# EAGLE design valentines-heart-punk-r1.1-rotated (EAGLE 5.12)
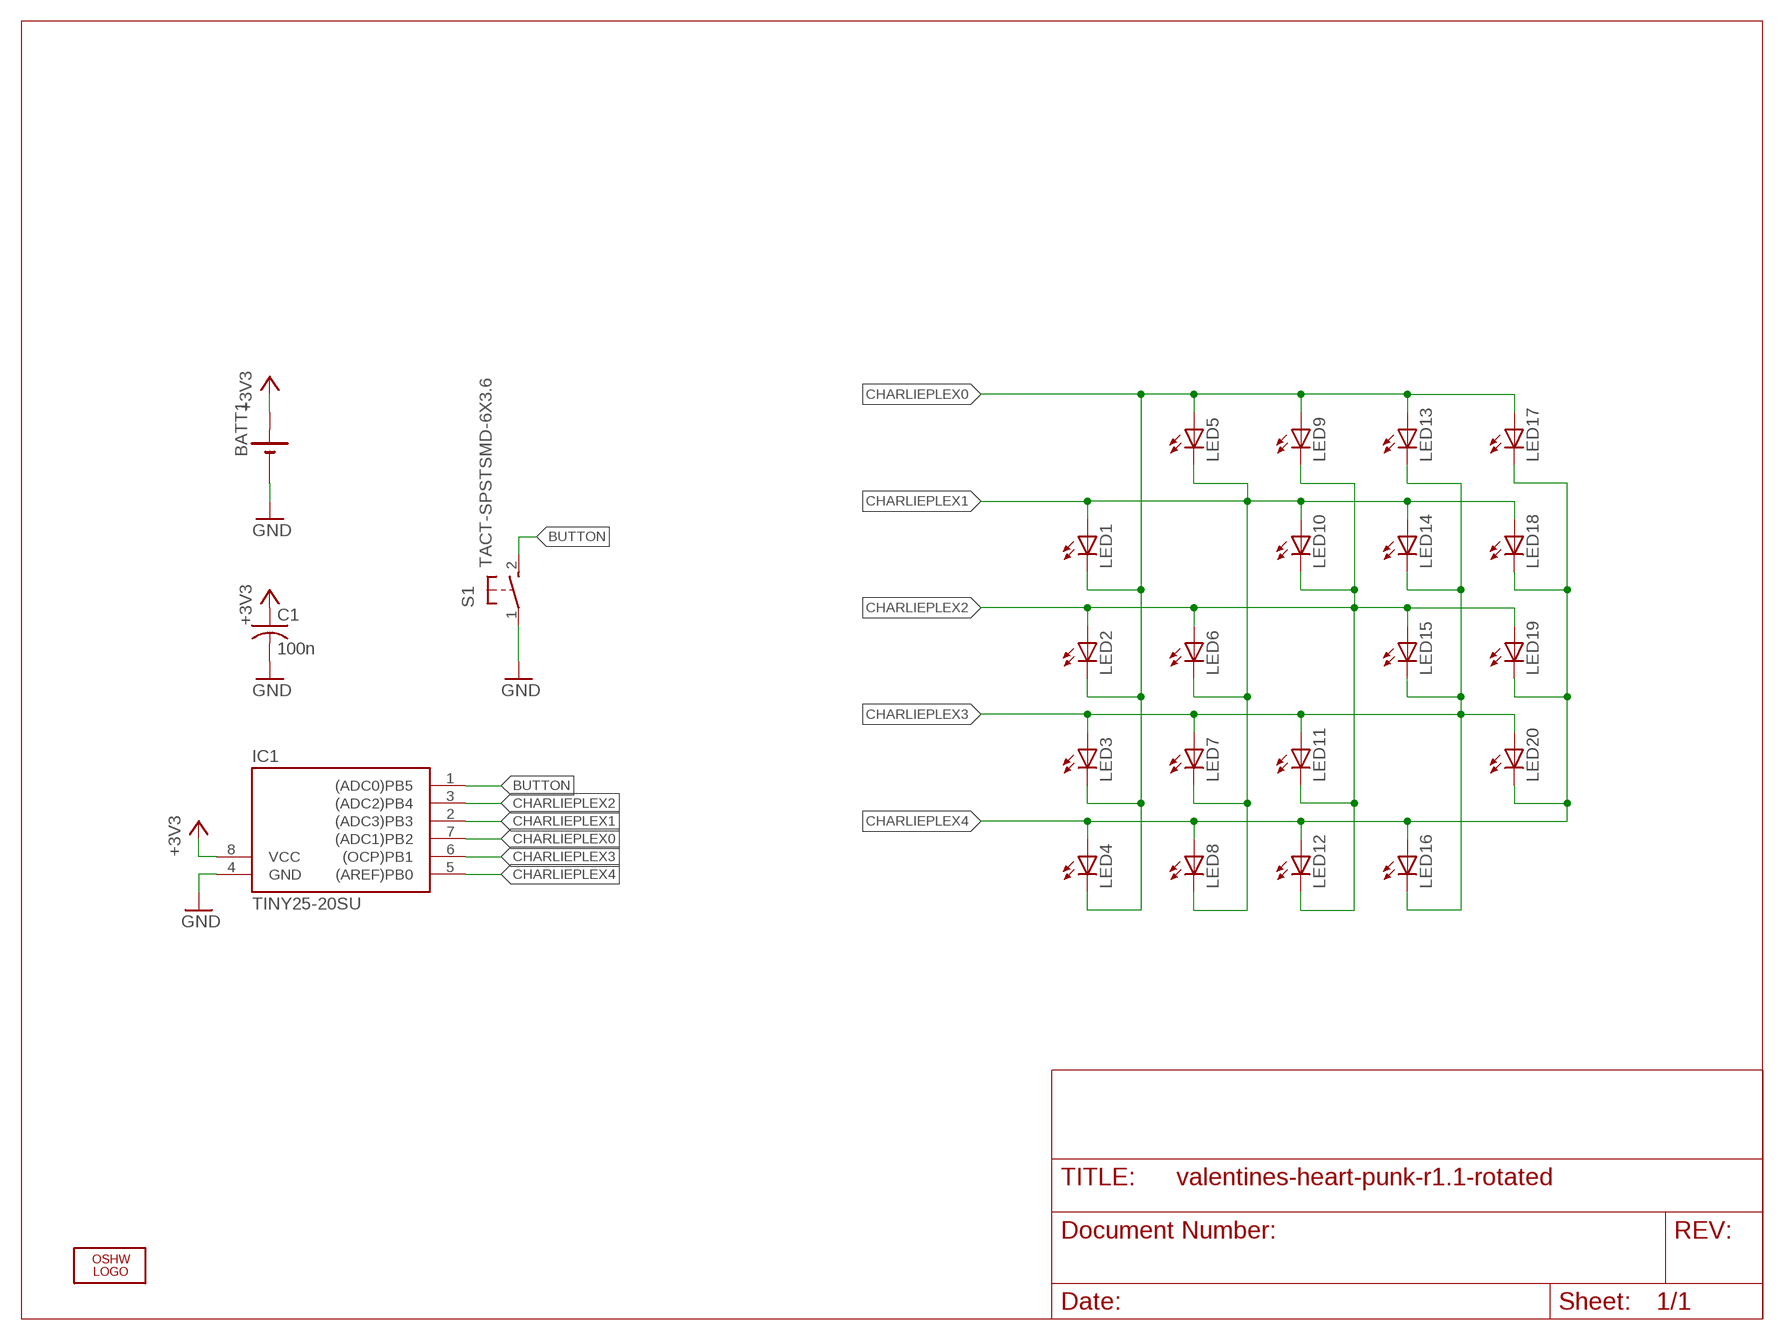
[diagram p0: schematic, sheet 1]

## Parts
BATT1  2032SMD  [2032SMD]
C1  100n  C-USC0603  [C0603]
IC1  TINY25-20SU  [SOIC8]
LED1  LEDCHIPLED_0805  [CHIPLED_0805]
LED2  LEDCHIPLED_0805  [CHIPLED_0805]
LED3  LEDCHIPLED_0805  [CHIPLED_0805]
LED4  LEDCHIPLED_0805  [CHIPLED_0805]
LED5  LEDCHIPLED_0805  [CHIPLED_0805]
LED6  LEDCHIPLED_0805  [CHIPLED_0805]
LED7  LEDCHIPLED_0805  [CHIPLED_0805]
LED8  LEDCHIPLED_0805  [CHIPLED_0805]
LED9  LEDCHIPLED_0805  [CHIPLED_0805]
LED10  LEDCHIPLED_0805  [CHIPLED_0805]
LED11  LEDCHIPLED_0805  [CHIPLED_0805]
LED12  LEDCHIPLED_0805  [CHIPLED_0805]
LED13  LEDCHIPLED_0805  [CHIPLED_0805]
LED14  LEDCHIPLED_0805  [CHIPLED_0805]
LED15  LEDCHIPLED_0805  [CHIPLED_0805]
LED16  LEDCHIPLED_0805  [CHIPLED_0805]
LED17  LEDCHIPLED_0805  [CHIPLED_0805]
LED18  LEDCHIPLED_0805  [CHIPLED_0805]
LED19  LEDCHIPLED_0805  [CHIPLED_0805]
LED20  LEDCHIPLED_0805  [CHIPLED_0805]
LOGO1  OSHW_LOGO_FILLX0100-NT  [OSHW_FILLX100_NOTEXT]
S1  TACT-SPSTSMD-6X3.6  [6X3.6-SPST]

## Nets
+3V3: BATT1.+ C1.1 IC1.8(VCC)
BUTTON: IC1.1((ADC0)PB5) S1.2(S)
CHARLIEPLEX0: IC1.7((ADC1)PB2) LED1.C LED2.C LED3.C LED4.C LED5.A LED9.A LED13.A LED17.A
CHARLIEPLEX1: IC1.2((ADC3)PB3) LED1.A LED5.C LED6.C LED7.C LED8.C LED10.A LED14.A LED18.A
CHARLIEPLEX2: IC1.3((ADC2)PB4) LED2.A LED6.A LED9.C LED10.C LED11.C LED12.C LED15.A LED19.A
CHARLIEPLEX3: IC1.6((OCP)PB1) LED3.A LED7.A LED11.A LED13.C LED14.C LED15.C LED16.C LED20.A
CHARLIEPLEX4: IC1.5((AREF)PB0) LED4.A LED8.A LED12.A LED16.A LED17.C LED18.C LED19.C LED20.C
GND: BATT1.- C1.2 IC1.4(GND) S1.1(P)

## Library data of the parts
BATT1 = rbg-4ucon-battery:2032SMD
C1 = rcl:C-US: CAPACITOR, American symbol
IC1 = avr-5-4.16:TINY25
LED1-LED20 = led:LED: LED OSRAM: - CHIPLED LG R971, LG N971, LY N971, LG Q971, LY Q971, LO R971, LY R971 LH N974, LH R974 LS Q976, LO Q976, LY Q976 LO Q996 - Hyper CHIPLED LW Q18S LB Q993, LB Q99A, LB R99A - SideLED LS A670, LO A670, LY A670, LG A670, LP A670 LB A673, LV A673, LT A673, LW A673 LH A674 LY A675 LS A676, LA A676, LO A676, LY A676, LW A676 LS A679, LY A679, LG A679 - Hyper Micro SIDELED® LS Y876, LA Y876, LO Y876, LY Y876 LT Y87S - SmartLED LW L88C, LW L88S LB L89C, LB L89S, LG L890 LS L89K, LO L89K, LY L89K LS L896, LA L896, LO L896, LY L896 - TOPLED LS T670, LO T670, LY T670, LG T670, LP T670 LSG T670, LSP T670, LSY T670, LOP T670, LYG T670 LG T671, LOG T671, LSG T671 LB T673, LV T673, LT T673, LW T673 LH T674 LS T676, LA T676, LO T676, LY T676, LB T676, LH T676, LSB T676, LW T676 LB T67C, LV T67C, LT T67C, LS T67K, LO T67K, LY T67K, LW E67C LS E67B, LA E67B, LO E67B, LY E67B, LB E67C, LV E67C, LT E67C LW T67C LS T679, LY T679, LG T679 LS T770, LO T770, LY T770, LG T770, LP T770 LB T773, LV T773, LT T773, LW T773 LH T774 LS E675, LA E675, LY E675, LS T675 LS T776, LA T776, LO T776, LY T776, LB T776 LHGB T686 LT T68C, LB T68C - Hyper Mini TOPLED® LB M676 - Mini TOPLED Santana® LG M470 LS M47K, LO M47K, LY M47K Source: http://www.osram.convergy.de LUXEON: - LUMILED® LXK2-PW12-R00, LXK2-PW12-S00, LXK2-PW14-U00, LXK2-PW14-V00 LXK2-PM12-R00, LXK2-PM12-S00, LXK2-PM14-U00 LXK2-PE12-Q00, LXK2-PE12-R00, LXK2-PE12-S00, LXK2-PE14-T00, LXK2-PE14-U00 LXK2-PB12-K00, LXK2-PB12-L00, LXK2-PB12-M00, LXK2-PB14-N00, LXK2-PB14-P00, LXK2-PB14-Q00 LXK2-PR12-L00, LXK2-PR12-M00, LXK2-PR14-Q00, LXK2-PR14-R00 LXK2-PD12-Q00, LXK2-PD12-R00, LXK2-PD12-S00 LXK2-PH12-R00, LXK2-PH12-S00 LXK2-PL12-P00, LXK2-PL12-Q00, LXK2-PL12-R00 Source: www.luxeon.com KINGBRIGHT: KA-3528ASYC Source: www.kingbright.com
LOGO1 = ohw-logo:OSHW_LOGO_FILL
S1 = rbg-generic-tact-switch:TACT-SPST

## Board
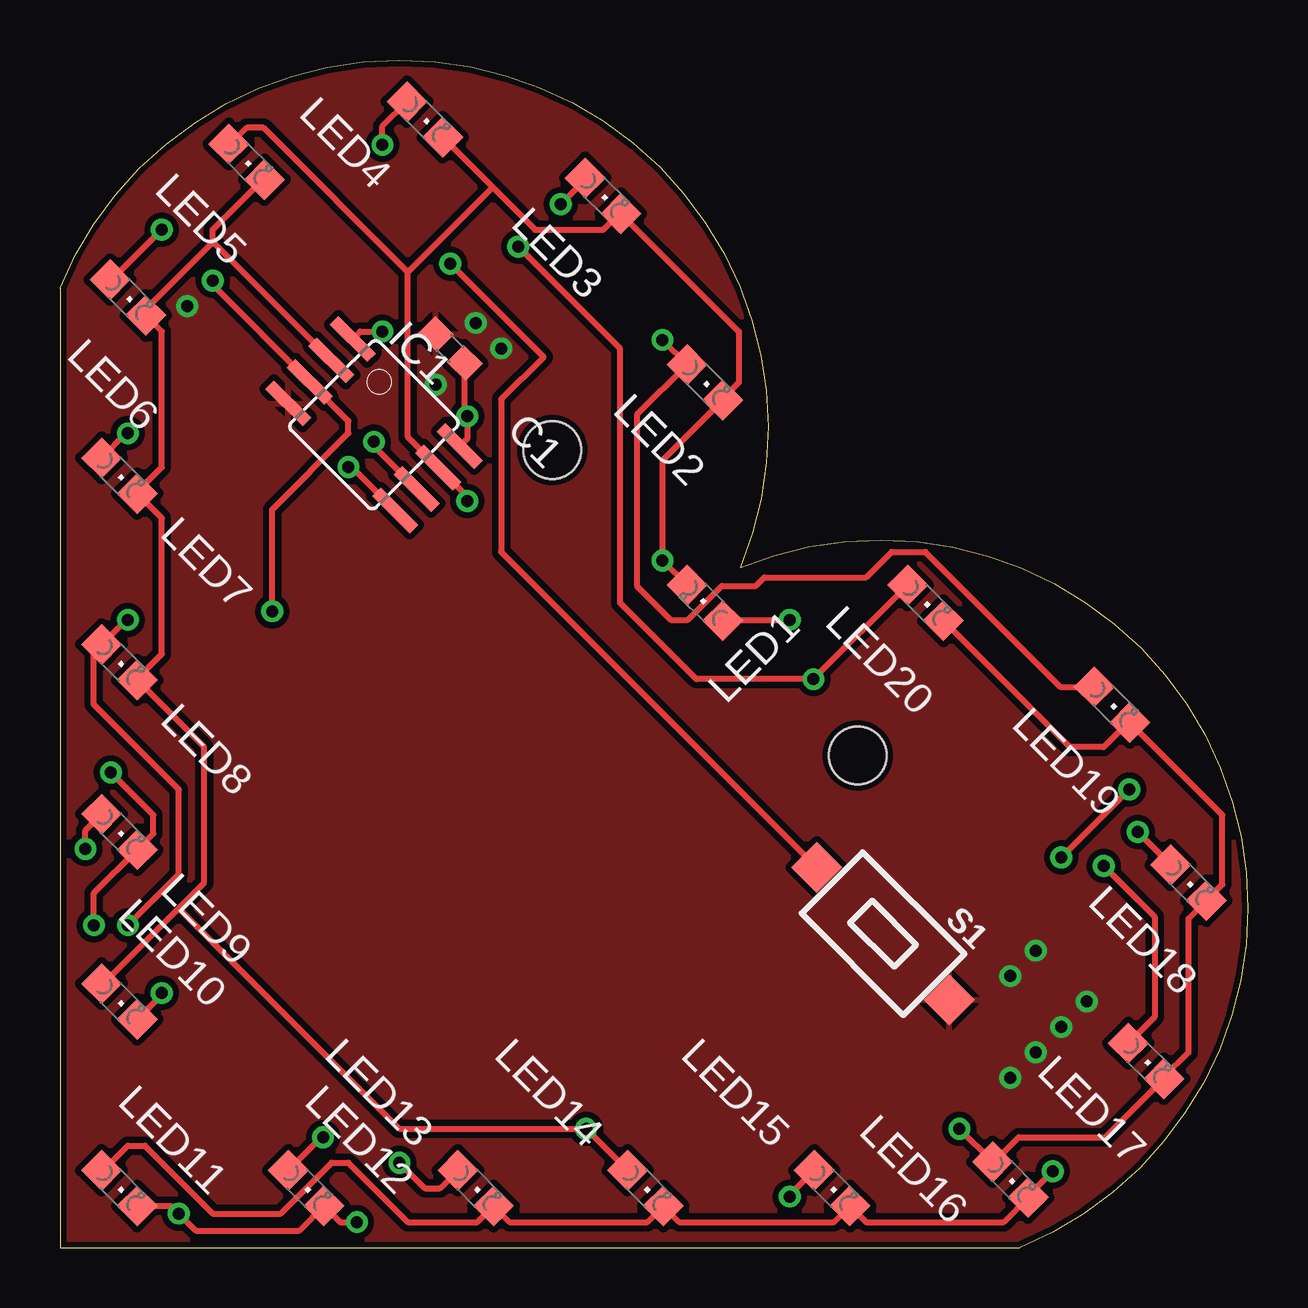
[diagram p1: board, top side]
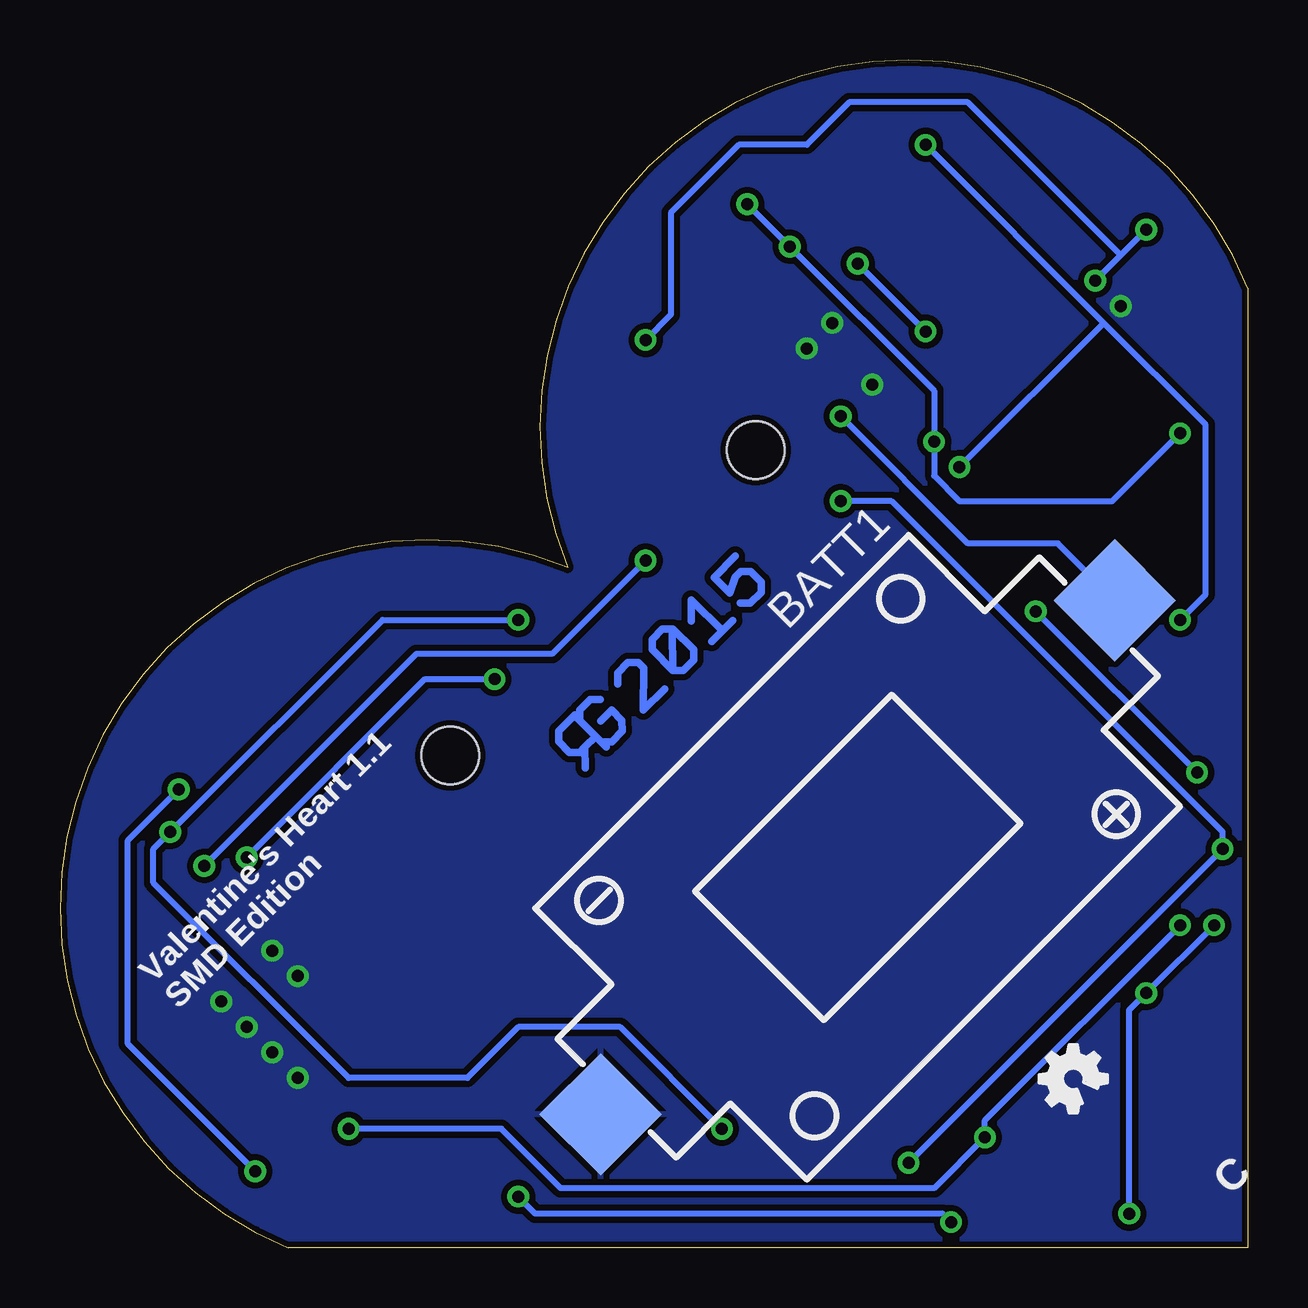
[diagram p2: board, bottom side, seen from below]

Size 49.5 x 49.5 mm. Coordinates in mm from the lower left corner, seen from the top.
Outline: 0,0 40,0 arc180 28.35,28.35 arc180 0,40 0,0
Copper layers (1*16): Top 0.035mm / dielectric 1.5mm / Bottom 0.035mm
Design rules "default *": minimum track width 10mil, minimum drill 0.5mm, track to track 8mil, track to pad 8mil, pad to pad 8mil, via to via 8mil, smd to smd 8mil, copper to edge 10mil, drill to drill 8mil, minimum pad ring 10mil, minimum via ring 8mil, stop-mask expansion 4mil, vias tented up to drill 20mil, thermal gap 10mil
Holes 2.4 mm at 20.51,33.23 33.23,20.51

### Footprints (pad centres in the part's own frame; a part is rotated, then mirrored left to right if it is on the bottom)
2032SMD = smd 3.6 x 3.6: + -15.15,0; - 15.15,0
C0603 = smd 1.1 x 1: 1 -0.85,0; 2 0.85,0
SOIC8 = smd 0.5 x 2.2: 1 -1.905,-3.154; 2 -0.645,-3.154; 3 0.625,-3.154; 4 1.895,-3.154; 5 1.905,3.154; 6 0.635,3.154; 7 -0.635,3.154; 8 -1.905,3.154
CHIPLED_0805 = smd 1.2 x 1.2: A 0,-1.05; C 0,1.05
6X3.6-SPST = smd 1.5 x 1.5: 1 -3.9,0; 2 3.9,0

### Placement (x,y rotation side)
BATT1  16.26,16.26 225 bottom
C1  16.26,37.48 135 top
IC1  13.08,34.29 225 top
LED1  26.87,26.87 45 top
LED2  26.87,36.06 225 top
LED3  22.63,43.84 225 top
LED4  15.2,47.02 225 top
LED5  7.78,45.25 225 top
LED6  2.83,39.6 225 top
LED7  2.47,32.17 225 top
LED8  2.47,24.4 225 top
LED9  2.47,17.32 225 top
LED10  2.47,10.25 225 top
LED11  2.47,2.47 225 top
LED12  10.25,2.47 225 top
LED13  17.32,2.47 225 top
LED14  24.4,2.47 225 top
LED15  32.17,2.47 225 top
LED16  39.6,2.83 225 top
LED17  45.25,7.78 225 top
LED18  47.02,15.2 225 top
LED19  43.84,22.63 225 top
LED20  36.06,26.87 225 top
LOGO1  7.5,5.23 45 bottom
S1  34.29,13.08 135 top
U$1  [RGLOGO_SMALL_2015]  26.52,20.86 45 bottom

### Tracks (layer width: path | path; a pad name or v marks a point on that pad's centre or on a via)
+3V3  (via drill 0.5)
  Top 0.254: v16.97,34.65 16.86,34.75 C1.1 | v16.97,34.65 16.97,34.48 | IC1.8 16.97,33.72 v16.97,34.65
  Bottom 0.254: BATT1.+ 7.92,29.34 11.67,29.34 v16.97,34.65
BUTTON  (via drill 0.5)
  Top 0.254: S1.2 18.39,28.99 18.39,35.35 20.15,37.12 v16.26,41.01 | IC1.1 12.51,38.18 v13.44,38.18
  Bottom 0.254: v13.44,38.18 v16.26,41.01
CHARLIEPLEX0  (via drill 0.5)
  Top 0.254: LED1.C v25.1,28.64 25.1,32.81 LED2.C 27.61,35.39 28.28,36.06 28.28,38.18 LED3.C 23.3,43.1 22.63,42.43 19.8,42.43 18.03,44.19 | 18.03,44.19 LED4.C | 14.5,40.66 8.48,46.67 7.78,46.67 7.11,46 LED5.A | 14.5,40.66 14.5,33.78 IC1.7 16.97,31.3 v16.97,31.11 | LED9.A 1.06,17.39 v1.06,16.62 | LED13.A 15.84,2.48 15.2,2.48 v14.14,3.54 | LED17.A 45.61,9.62 45.61,13.79 v43.49,15.91 | 14.5,40.66 18.03,44.19
  Bottom 0.254: v14.14,3.54 v1.06,16.62 1.06,17.32 14.85,31.11 v16.97,31.11 | v43.49,15.91 34.65,24.75 28.99,24.75 v25.1,28.64
CHARLIEPLEX1  (via drill 0.5)
  Top 0.254: 6.36,41.92 6.36,41.91 3.57,39.12 LED6.C 4.24,38.18 4.24,32.53 3.22,31.5 LED7.C 4.24,30.41 4.24,24.75 3.22,23.72 LED8.C 6.01,20.86 6.01,15.2 4.95,14.14 | LED5.C 8.45,44.51 6.36,42.43 6.36,41.92 | 4.95,14.14 1.8,10.99 LED10.A | 4.95,14.14 14.14,4.95 v21.92,4.95 LED14.A | v44.9,17.32 LED18.A | v30.41,26.16 30.37,26.13 LED1.A | 6.36,41.92 IC1.2
  Bottom 0.254: v30.41,26.16 36.06,26.16 v44.9,17.32 45.61,16.62 45.61,15.2 37.48,7.07 32.53,7.07 30.41,9.19 26.16,9.19 v21.92,4.95
CHARLIEPLEX2  (via drill 0.5)
  Top 0.254: 6.36,40.11 v6.36,40.3 6.36,40.13 IC1.3 12.02,34.46 12.02,33.94 8.84,30.76 v8.84,26.52 | v4.24,42.43 2.16,40.34 LED6.A | LED19.A 41.68,23.37 36.06,28.99 34.65,28.99 33.59,27.93 29.34,27.93 28.99,27.58 27.58,27.58 26.16,26.16 25.46,26.16 24.04,27.58 24.04,34.72 LED2.A v25.1,37.83 | v1.41,13.44 1.41,14.78 LED9.C 3.89,17.25 3.89,18.03 v2.12,19.8 | LED10.C 4.24,10.54 v4.24,10.61 | LED15.A 30.41,2.19 v30.41,2.12 | v12.37,1.06 11.67,1.06 LED12.C 9.97,0.71 5.66,0.71 v4.95,1.41 4.63,1.73 LED11.C
  Bottom 0.254: 5.3,41.37 v4.24,42.43 | v6.36,40.3 5.3,41.37 | v1.41,13.44 v4.24,10.61 4.95,9.9 v4.95,1.41 | v30.41,2.12 29.7,1.41 12.73,1.41 v12.37,1.06 | v25.1,37.83 24.04,38.89 24.04,43.13 21.21,45.96 18.39,45.96 16.62,47.73 11.67,47.73 5.3,41.37 | v2.12,19.8 v8.84,26.52
CHARLIEPLEX3  (via drill 0.5)
  Top 0.254: LED11.A 1.8,3.22 2.83,4.24 3.54,4.24 6.36,1.41 9.19,1.41 11.31,3.54 12.02,3.54 14.5,1.06 17.39,1.06 LED13.C 18.74,1.06 24.47,1.06 LED14.C 25.81,1.06 32.24,1.06 LED15.C 33.59,1.06 39.31,1.06 LED16.C 40.34,2.16 v41.37,3.18 | v20.86,43.49 21.92,44.55 LED3.A | LED7.A 2.76,33.94 v2.83,33.94 | v19.09,41.72 23.33,37.48 23.33,26.87 26.52,23.69 v31.39,23.69 LED20.A | v44.55,19.09 v41.72,16.26 | IC1.6 13.08,33.4 v13.08,33.59
  Bottom 0.254: v20.86,43.49 v19.09,41.72 13.08,35.71 v13.08,33.59 13.08,32.17 12.02,31.11 5.66,31.11 v2.83,33.94 | v31.39,23.69 34.3,23.69 v41.72,16.26 | v44.55,19.09 46.67,16.97 46.67,8.48 v41.37,3.18
CHARLIEPLEX4  (via drill 0.5)
  Top 0.254: LED20.C 42.07,20.86 43.49,20.86 44.51,21.89 LED19.C 48.44,18.03 48.44,15.13 LED18.C 47.02,13.72 47.02,8.13 46,7.11 LED17.C 43.56,4.6 39.95,4.6 38.93,3.57 LED16.A v37.48,4.95 | LED4.A 13.44,46.74 v13.44,45.96 | v2.83,26.16 2.76,26.16 LED8.A 1.41,24.82 1.41,22.63 4.95,19.09 4.95,15.56 v2.83,13.44 | LED12.A 10.89,4.6 v10.96,4.6 | IC1.5 12.15,32.53 v12.02,32.53
  Bottom 0.254: 6.01,38.54 v13.44,45.96 | 6.01,38.54 v12.02,32.53 | v2.83,26.16 1.77,27.22 1.77,34.3 6.01,38.54 | v37.48,4.95 31.11,4.95 28.64,2.48 13.08,2.48 v10.96,4.6 10.96,5.3 v2.83,13.44
GND  (via drill 0.5)
  other vias: 42.78,10.25 41.72,9.19 40.66,8.13 39.6,7.07 40.66,12.37 39.6,11.31 17.32,38.54 18.38,37.48 15.65,35.97 5.3,39.24
  pour Bottom (isolate 0.254): 14.85,57.28 57.98,14.14 18.74,-25.1 -24.4,18.03
  pour Top (isolate 0.254): 14.85,57.28 57.98,14.14 18.74,-25.1 -24.4,18.03

### Text on the board
bNames: Valentine's Heart 1.1 | SMD Edition | C